# EAGLE design ESP (EAGLE 7.6.0)
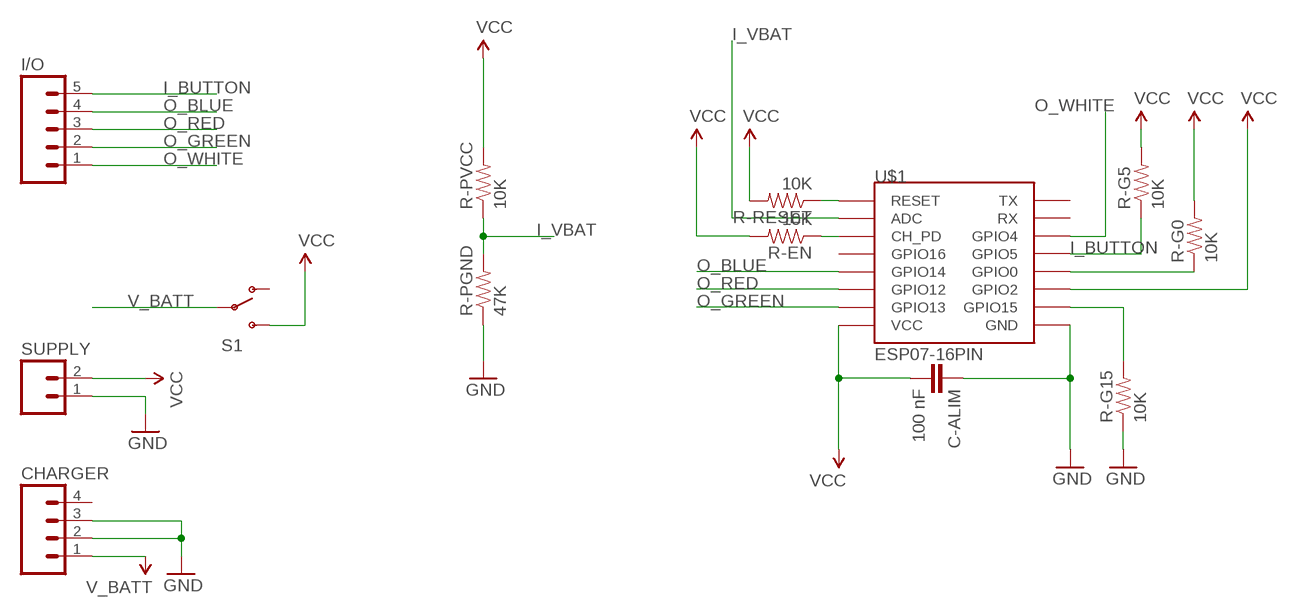
[diagram p0: schematic, sheet 1]

## Parts
C-ALIM  100 nF  CAP0805  [0805]
CHARGER  M04NO_SILK_ALL_ROUND  [1X04_NO_SILK_ALL_ROUND]
I/O  M05NO_SILK  [1X05_NO_SILK]
R-EN  10K  RESISTOR0805-RES  [0805]
R-G0  10K  RESISTOR0805-RES  [0805]
R-G5  10K  RESISTOR0805-RES  [0805]
R-G15  10K  RESISTOR0805-RES  [0805]
R-PGND  47K  RESISTOR0805-RES  [0805]
R-PVCC  10K  RESISTOR0805-RES  [0805]
R-RESET  10K  RESISTOR0805-RES  [0805]
S1  SWITCH-SPDTSMD2  [SWITCH-SPDT-SMD]
SUPPLY  M021X02_NO_SILK  [1X02_NO_SILK]
U$1  ESP07-16PIN  [ESP07-16PIN]

## Nets
GND: C-ALIM.1 CHARGER.2 CHARGER.3 R-G15.1 R-PGND.1 SUPPLY.1 U$1.GND
I_BUTTON: I/O.5 R-G5.1 U$1.GPIO5
I_VBAT: R-PGND.2 R-PVCC.1 U$1.ADC
N$1: R-G15.2 U$1.GPIO15
N$6: R-G0.1 U$1.GPIO0
N$9: R-RESET.1 U$1.REST(RESET)
N$10: R-EN.1 U$1.CH_PD
O_BLUE: I/O.4 U$1.GPIO14
O_GREEN: I/O.2 U$1.GPIO13
O_RED: I/O.3 U$1.GPIO12
O_WHITE: I/O.1 U$1.GPIO4
V_BATT [SUPPLY]: CHARGER.1 S1.2(P)
VCC [SUPPLY]: C-ALIM.2 R-EN.2 R-G0.2 R-G5.2 R-PVCC.2 R-RESET.2 S1.3(S) SUPPLY.2 U$1.GPIO2 U$1.VCC
Unconnected: CHARGER.4 S1.1(O) U$1.GPIO16 U$1.RX U$1.TX

## Library data of the parts
C-ALIM = SparkFun-Capacitors:CAP: Capacitor Standard 0603 ceramic capacitor, and 0.1" leaded capacitor.
CHARGER = SparkFun-Connectors:M04: Header 4 Standard 4-pin 0.1" header. Use with straight break away headers (SKU : PRT-00116), right angle break away headers (PRT-00553), swiss pins (PRT-00743), machine pins (PRT-00117), and female headers (PRT-00115). Molex polarized connector foot print use with SKU : PRT-08231 with associated crimp pins and housings. 1MM SMD Version SKU: PRT-10208; PROD_ID: CONN-09696
I/O = SparkFun-Connectors:M05: Header 5 Standard 5-pin 0.1" header. Use with straight break away headers (SKU : PRT-00116), right angle break away headers (PRT-00553), swiss pins (PRT-00743), machine pins (PRT-00117), and female headers (PRT-00115). Molex polarized connector foot print use with SKU : PRT-08230 with associated crimp pins and housings.
R-EN R-G0 R-G5 R-G15 R-PGND R-PVCC R-RESET = SparkFun-Resistors:RESISTOR: Resistor Basic schematic elements and footprints for 0603, 1206, and PTH resistors.
S1 = lio:SWITCH-SPDT: SPDT Switch Simple slide switch, Spark Fun Electronics SKU : COM-00102 DPDT SMT slide switch, AYZ0202, SWCH-08179
SUPPLY = SparkFun-Connectors:M02: Standard 2-pin 0.1" header. Use with - straight break away headers ( PRT-00116) - right angle break away headers (PRT-00553) - swiss pins (PRT-00743) - machine pins (PRT-00117) - female headers (PRT-00115) Molex polarized connector foot print use with: PRT-08233 with associated crimp pins and housings. 2.54_SCREWTERM for use with PRT-10571. 3.5mm Screw Terminal footprints for PRT-08084 5mm Screw Terminal footprints for use with PRT-08432
U$1 = esp8266modules:ESP07-16PIN: ESP8266 Wifi module 07 - 16 pins; DIMENSIONS: 22.0 x 16.0 mm; PINS: 16; PITCH: 0.078" / 2 mm

## Net classes
0 default: width 0.3 mm
1 GND: width 0.5 mm, clearance 0.5 mm
2 SUPPLY: width 0.5 mm, clearance 0.003 mm

## Board
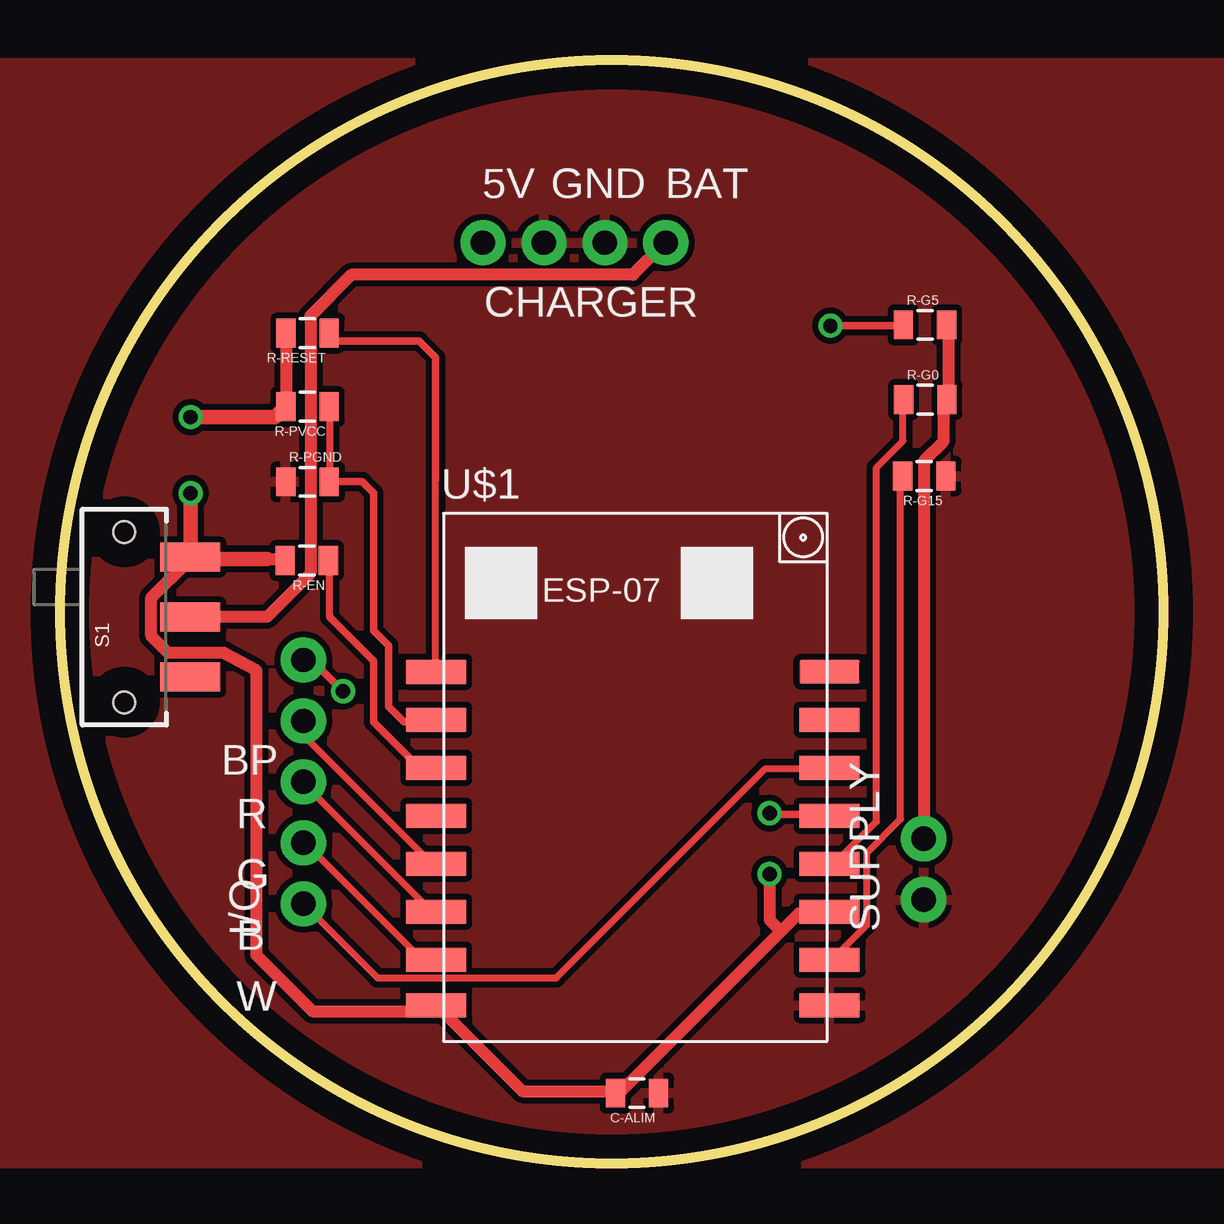
[diagram p1: board, top side]
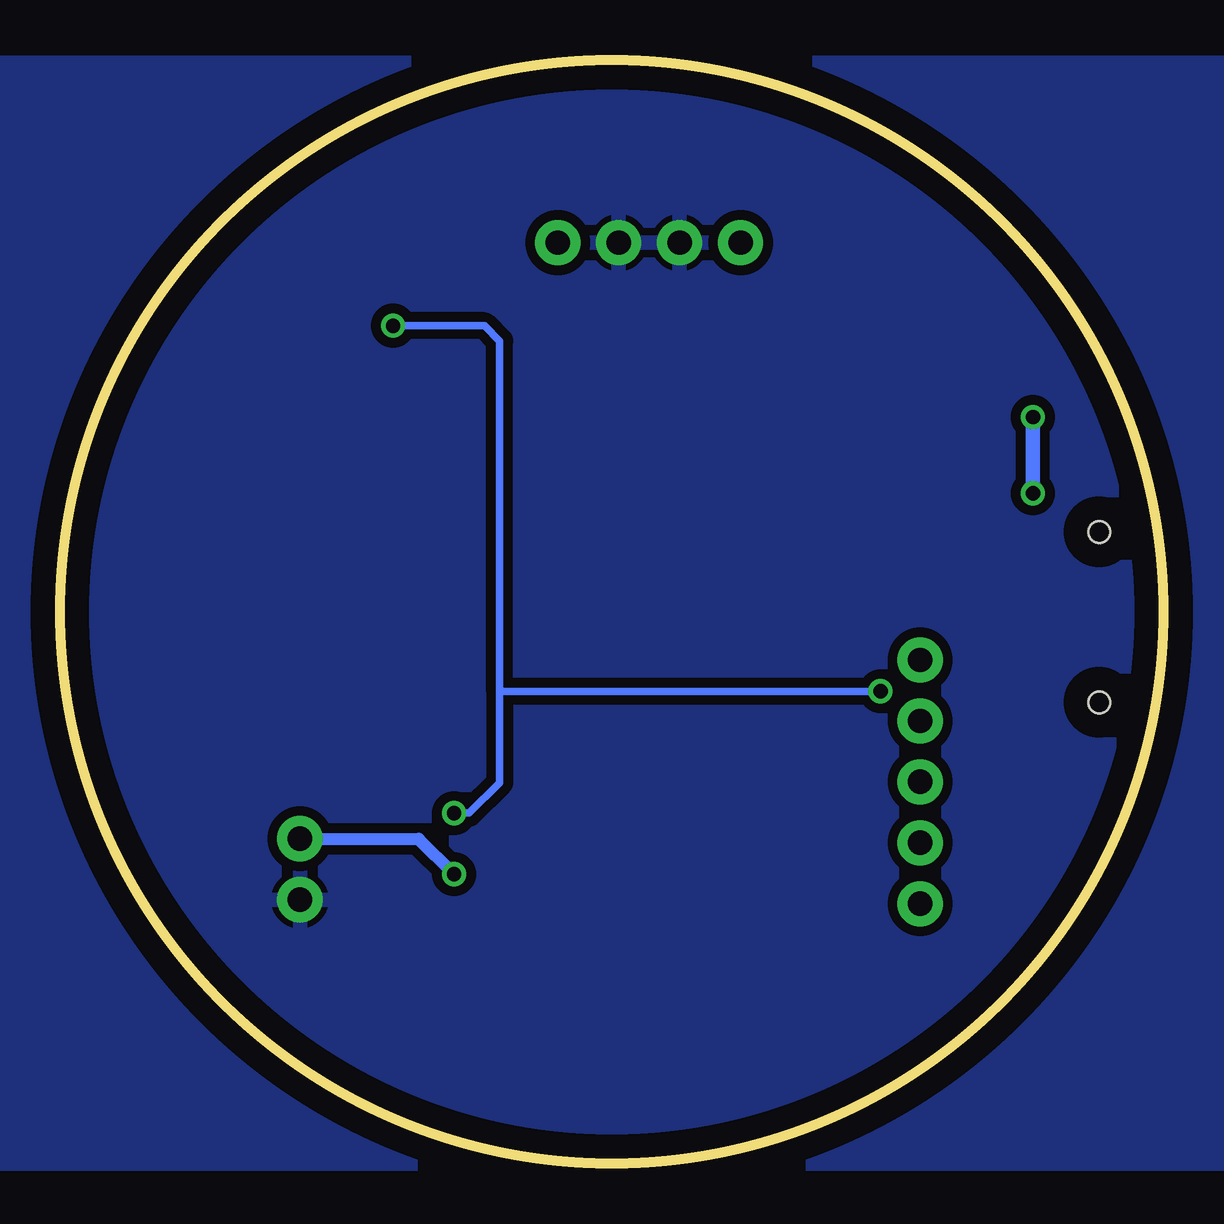
[diagram p2: board, bottom side, seen from below]

Size 46 x 46 mm. Coordinates in mm from the lower left corner, seen from the top.
Outline: circle at 23,23 radius 23
Copper layers (1*16): Top 0.035mm / dielectric 1.5mm / Bottom 0.035mm
Design rules "baballe": minimum track width 5mil, minimum drill 24mil, track to track 4mil, track to pad 4mil, pad to pad 4mil, via to via 4mil, smd to smd 2mil, copper to edge 40mil, drill to drill 8mil, minimum pad ring 10mil, minimum via ring 8mil, stop-mask expansion 4mil, vias tented up to drill 0mil, thermal gap 10mil

### Footprints (pad centres in the part's own frame; a part is rotated, then mirrored left to right if it is on the bottom)
0805 = smd 0.8 x 1.2: 1 -0.9,0; 2 0.9,0
1X04_NO_SILK_ALL_ROUND = drill 1.016 pad 1.88: 1 0,0; 2 2.54,0; 3 5.08,0; 4 7.62,0
1X05_NO_SILK = drill 1.016 pad 1.88: 1 0,0; 2 2.54,0; 3 5.08,0; 4 7.62,0; 5 10.16,0
SWITCH-SPDT-SMD = smd 1.2 x 2.5: 1 -2.5,-2.75; 2 0,-2.75; 3 2.5,-2.75 | hole 0.9: -3.55,0; 3.55,0
1X02_NO_SILK = drill 1.016 pad 1.88: 1 0,0; 2 2.54,0
ESP07-16PIN = smd 2.5 x 1: ADC -8.2,3.8; CH_PD -8.2,1.8; GND 8.2,-8.105; GPIO0 8.2,-2.2; GPIO2 8.2,-4.2; GPIO4 8.2,1.8; GPIO5 8.2,-0.2; GPIO12 -8.2,-4.2; GPIO13 -8.2,-6.2; GPIO14 -8.2,-2.2; GPIO15 8.2,-6.2; GPIO16 -8.2,-0.2; REST -8.2,5.8; RX 8.2,3.8; TX 8.2,5.8; VCC -8.2,-8.105

### Placement (x,y rotation side)
C-ALIM  24.05,2.94 180 top
CHARGER  25.25,38.38 180 top
I/O  10.15,10.83 90 top
R-EN  10.29,25.13 180 top
R-G0  36.07,31.84 0 top
R-G5  36.06,34.96 0 top
R-G15  36.03,28.66 180 top
R-PGND  10.31,28.42 0 top
R-PVCC  10.32,31.55 180 top
R-RESET  10.32,34.61 180 top
S1  2.68,22.78 90 top
SUPPLY  36,11 90 top
U$1  23.88,14.7 0 top

### Tracks (layer width: path | path; a pad name or v marks a point on that pad's centre or on a via)
GND
  Top 0.3: 20.28,38.35 CHARGER.3 | CHARGER.2 22.69,38.35 22.66,38.44
  Bottom 0.3: 22.69,38.38 22.69,38.35 CHARGER.2 22.18,38.45 22.18,38.38
  pour Bottom (isolate 0.406): -4.08,0 51.8,0 51.8,45.88 -4.08,45.88
  pour Top (isolate 0.254): -4.08,45.88 51.8,45.88 51.8,0 -4.08,0
I_BUTTON  (via drill 0.6)
  Top 0.3: 32.33,14.56 32.12,14.56 U$1.GPIO5 | 35.14,34.94 R-G5.1 | 10.24,20.98 I/O.5
  Top 0.305: 10.24,20.98 10.5,20.98 v11.79,19.68 | 32.33,14.56 29.62,14.56 v29.57,14.61 | v32.11,34.92 35.13,34.92 R-G5.1 | 35.14,34.94 35.28,34.94 35.29,34.92
  Bottom 0.305: v11.79,19.68 27.67,19.68 | 27.67,19.68 27.67,15.88 28.94,14.61 v29.57,14.61 | 27.67,19.68 27.67,34.29 28.3,34.92 v32.11,34.92
I_VBAT
  Top 0.3: R-PGND.2 11.24,28.51 11.24,31.53 R-PVCC.1 | 15.46,18.57 15.66,18.57 U$1.ADC
  Top 0.305: R-PGND.2 12.58,28.42 13.06,27.94 13.06,22.23 13.7,21.59 13.7,19.05 14.34,18.41 15.6,18.41 U$1.ADC
N$1
  Top 0.3: R-G15.2 35.04,28.61 35.04,14.36 33.63,12.95 33.63,9.94 32.12,8.43 U$1.GPIO15
N$6
  Top 0.3: R-G0.1 35.14,31.83 35.14,30.12 34.03,29.02 34.03,14.26 32.33,12.55 32.12,12.55 U$1.GPIO0
N$9
  Top 0.3: 15.66,28.51 15.66,20.58 U$1.REST | 11.24,34.54 R-RESET.1
  Top 0.305: 15.66,28.51 15.66,33.6 14.97,34.29 11.54,34.29 R-RESET.1
N$10
  Top 0.3: 11.24,22.86 11.24,25.1 R-EN.1 | 15.46,16.57 15.66,16.57 U$1.CH_PD
  Top 0.305: 11.24,22.86 11.24,22.78 13.06,20.95 13.06,18.41 14.97,16.51 U$1.CH_PD
O_BLUE
  Top 0.3: U$1.GPIO14 15.66,12.55 15.46,12.55 10.24,17.77 10.24,18.37 I/O.4
O_GREEN
  Top 0.3: U$1.GPIO13 15.66,8.53 15.06,8.53 10.24,13.35 I/O.2
O_RED
  Top 0.3: U$1.GPIO12 15.66,10.54 15.46,10.54 10.14,15.86 I/O.3
O_WHITE
  Top 0.3: U$1.GPIO4 32.02,16.47 29.41,16.47 20.68,7.73 13.25,7.73 10.24,10.74 I/O.1
V_BATT
  Top 0.5: S1.2 5.52,22.79 8.63,22.79 10.44,24.6 10.44,35.34 12.14,37.05 23.89,37.05 25.2,38.35 CHARGER.1
VCC  (via drill 0.6)
  Top 0.5: R-G5.2 37.04,34.94 37.04,31.93 R-G0.2 36.84,31.63 36.84,30.12 36.04,29.32 36.04,13.55 SUPPLY.2 | R-RESET.2 9.43,34.54 9.43,31.63 R-PVCC.2 9.33,31.32 | R-EN.2 9.33,25.2 8.63,25.2 5.52,25.2 S1.3 5.32,25.1 3.81,23.59 3.81,21.99 4.51,21.29 6.82,21.29 8.2,20.55 8.2,8.68 | U$1.GPIO2 32.02,10.44 30.82,10.44 30.06,9.68 23.39,3.01 C-ALIM.2 23.09,3.01 19.27,3.01 15.76,6.53 U$1.VCC 15.46,6.63
  Top 0.508: 8.2,8.68 10.53,6.35 15.44,6.35 U$1.VCC | v29.57,12.06 29.57,10.16 30.06,9.68
  Top 0.61: 8.63,25.2 5.45,25.2 v5.45,27.94 | v5.45,31.11 8.98,31.11 R-PVCC.2
  Bottom 0.508: SUPPLY.2 31.05,13.54 v29.57,12.06
  Bottom 0.61: v5.45,27.94 v5.45,31.11

### Text on the board
tNames: 5V | GND | BAT | BP | R | G | B | W